# EAGLE design board (EAGLE 9.2.2)
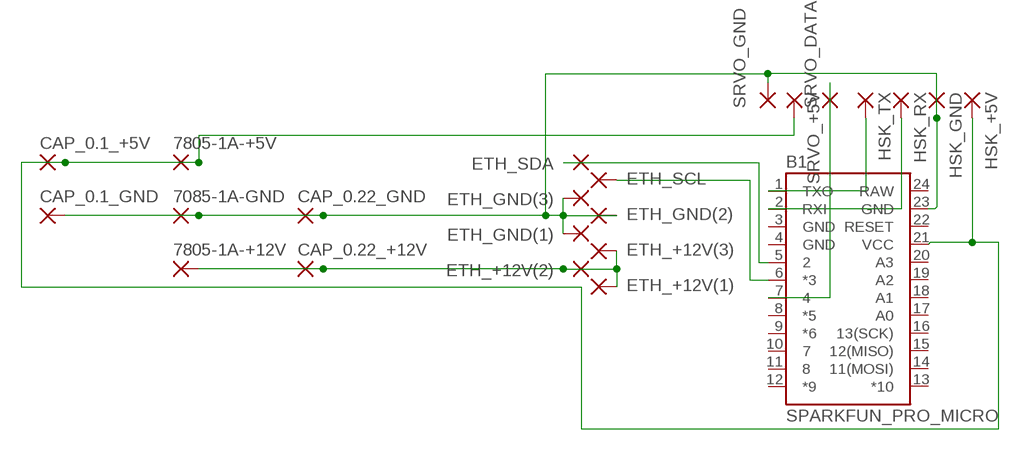
[diagram p0: schematic, sheet 1]

## Parts
7085-1A-GND  2,15/1,0  [2,15/1,0]
7805-1A-+5V  2,15/1,0  [2,15/1,0]
7805-1A-+12V  2,15/1,0  [2,15/1,0]
B1  SPARKFUN_PRO_MICRO  [SPARKFUN_PRO_MICRO]
CAP_0.1_+5V  2,15/1,0  [2,15/1,0]
CAP_0.1_GND  2,15/1,0  [2,15/1,0]
CAP_0.22_+12V  2,15/1,0  [2,15/1,0]
CAP_0.22_GND  2,15/1,0  [2,15/1,0]
ETH_+12V(1)  2,15/1,0  [2,15/1,0]
ETH_+12V(2)  2,15/1,0  [2,15/1,0]
ETH_+12V(3)  2,15/1,0  [2,15/1,0]
ETH_GND(1)  2,15/1,0  [2,15/1,0]
ETH_GND(2)  2,15/1,0  [2,15/1,0]
ETH_GND(3)  2,15/1,0  [2,15/1,0]
ETH_SCL  2,15/1,0  [2,15/1,0]
ETH_SDA  2,15/1,0  [2,15/1,0]
HSK_+5V  2,15/1,0  [2,15/1,0]
HSK_GND  2,15/1,0  [2,15/1,0]
HSK_RX  2,15/1,0  [2,15/1,0]
HSK_TX  2,15/1,0  [2,15/1,0]
SRVO_+5V  2,15/1,0  [2,15/1,0]
SRVO_DATA  2,15/1,0  [2,15/1,0]
SRVO_GND  2,15/1,0  [2,15/1,0]

## Nets
N$1: B1.5 ETH_SDA.1(P)
N$2: 7805-1A-+12V.1(P) CAP_0.22_+12V.1(P) ETH_+12V(1).1(P) ETH_+12V(2).1(P) ETH_+12V(3).1(P)
N$3: B1.1(TXO) HSK_TX.1(P)
N$4: B1.2(RXI) HSK_RX.1(P)
N$5: B1.7 SRVO_DATA.1(P)
N$6: 7085-1A-GND.1(P) B1.23(GND) CAP_0.1_GND.1(P) CAP_0.22_GND.1(P) ETH_GND(1).1(P) ETH_GND(2).1(P) ETH_GND(3).1(P) HSK_GND.1(P) SRVO_GND.1(P)
N$7: 7805-1A-+5V.1(P) B1.21(VCC) CAP_0.1_+5V.1(P) HSK_+5V.1(P) SRVO_+5V.1(P)
N$9: B1.6(*3) ETH_SCL.1(P)
Unconnected: B1.8(*5) B1.9(*6) B1.10 B1.11 B1.12(*9) B1.13(*10) B1.14(11(MOSI)) B1.15(12(MISO)) B1.16(13(SCK)) B1.17(A0) B1.18(A1) B1.19(A2) B1.20(A3) B1.22(RESET)

## Power pins joined to a net without a drawn wire
GND: B1.3(GND) B1.4(GND)
RAW: B1.24(RAW)

## Library data of the parts
7085-1A-GND 7805-1A-+5V 7805-1A-+12V CAP_0.1_+5V CAP_0.1_GND CAP_0.22_+12V CAP_0.22_GND ETH_+12V(1) ETH_+12V(2) ETH_+12V(3) ETH_GND(1) ETH_GND(2) ETH_GND(3) ETH_SCL ETH_SDA HSK_+5V HSK_GND HSK_RX HSK_TX SRVO_+5V SRVO_DATA SRVO_GND = wirepad:2,15/1,0: THROUGH-HOLE PAD
B1 = SparkFun-Boards:SPARKFUN_PRO_MICRO: SparkFun Pro Micro Atmega32U4 compatible footprint. SparkFun Products: 3.3V/8MHz <https://www.sparkfun.com/products/12587> 5V/16MHz <https://www.sparkfun.com/products/12640>

## Net classes
0 default: width 1.25 mm, clearance 0.5 mm

## Board
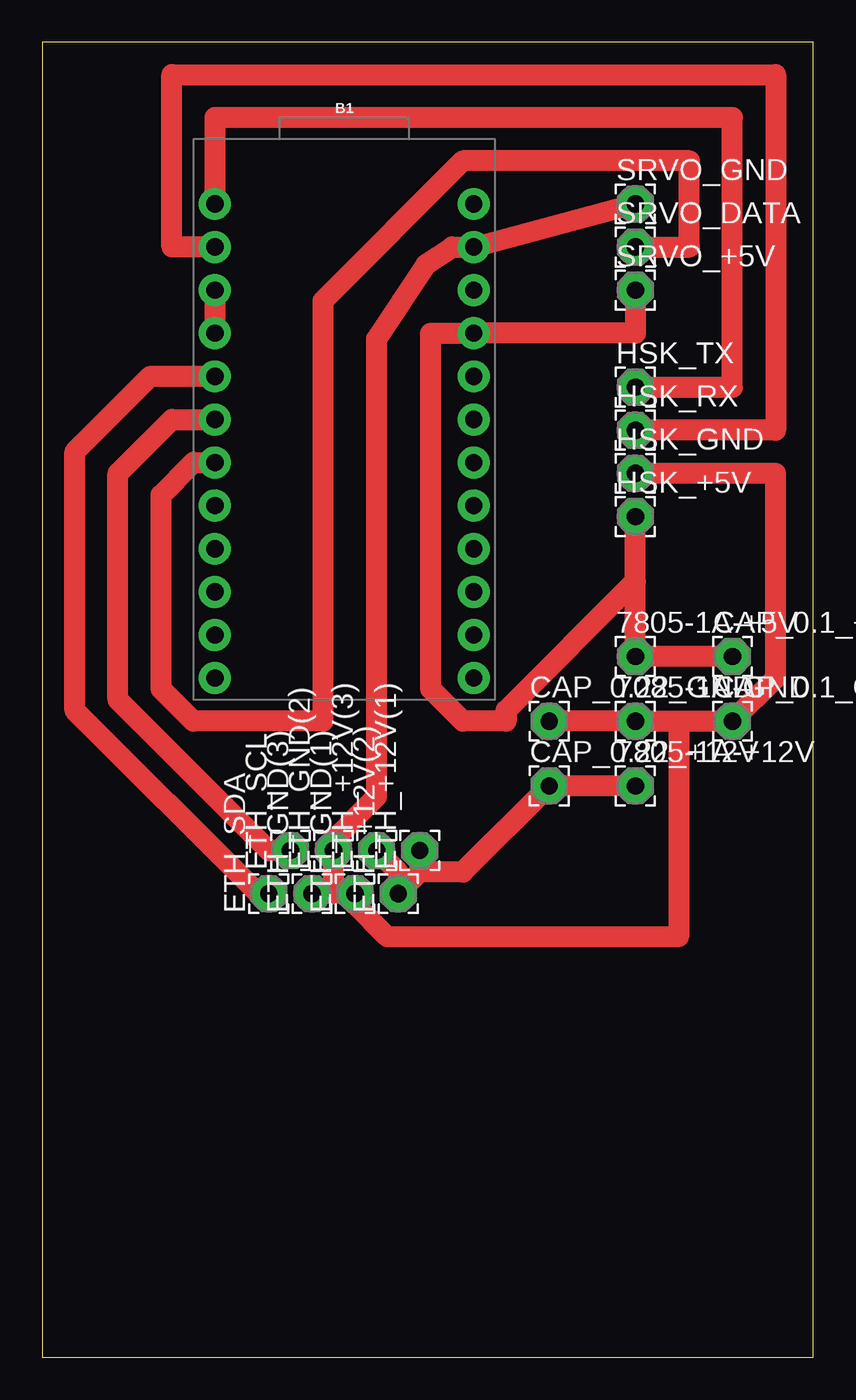
[diagram p1: board, top side]

Size 45.39 x 77.46 mm. Coordinates in mm from the lower left corner, seen from the top.
Outline: 0,0 45.39,0 45.39,77.46 0,77.46 0,0
Copper layers (1*16): Top 0.035mm / dielectric 1.5mm / Bottom 0.035mm
Design rules "default": minimum track width 6mil, minimum drill 0.35mm, track to track 6mil, track to pad 6mil, pad to pad 6mil, via to via 6mil, smd to smd 6mil, copper to edge 40mil, drill to drill 6mil, minimum pad ring 10mil, minimum via ring 8mil, stop-mask expansion 4mil, vias tented up to drill 0mil, thermal gap 10mil

### Footprints (pad centres in the part's own frame; a part is rotated, then mirrored left to right if it is on the bottom)
2,15/1,0 = drill 1.016 pad 2.159 octagon: 1 0,0
SPARKFUN_PRO_MICRO = drill 1.016 pad 1.88: 1 -7.62,12.7; 2 -7.62,10.16; 3 -7.62,7.62; 4 -7.62,5.08; 5 -7.62,2.54; 6 -7.62,0; 7 -7.62,-2.54; 8 -7.62,-5.08; 9 -7.62,-7.62; 10 -7.62,-10.16; 11 -7.62,-12.7; 12 -7.62,-15.24; 13 7.62,-15.24; 14 7.62,-12.7; 15 7.62,-10.16; 16 7.62,-7.62; 17 7.62,-5.08; 18 7.62,-2.54; 19 7.62,0; 20 7.62,2.54; 21 7.62,5.08; 22 7.62,7.62; 23 7.62,10.16; 24 7.62,12.7

### Placement (x,y rotation side)
7085-1A-GND  34.92,37.47 0 top
7805-1A-+5V  34.92,41.27 0 top
7805-1A-+12V  34.92,33.66 0 top
B1  17.78,55.24 0 top
CAP_0.1_+5V  40.64,41.27 0 top
CAP_0.1_GND  40.64,37.47 0 top
CAP_0.22_+12V  29.84,33.66 0 top
CAP_0.22_GND  29.84,37.47 0 top
ETH_+12V(1)  22.22,29.84 90 top
ETH_+12V(2)  20.96,27.3 90 top
ETH_+12V(3)  19.68,29.84 90 top
ETH_GND(1)  18.41,27.3 90 top
ETH_GND(2)  17.14,29.84 90 top
ETH_GND(3)  15.87,27.3 90 top
ETH_SCL  14.61,29.84 90 top
ETH_SDA  13.33,27.3 90 top
HSK_+5V  34.92,49.53 0 top
HSK_GND  34.92,52.07 0 top
HSK_RX  34.92,54.61 0 top
HSK_TX  34.92,57.15 0 top
SRVO_+5V  34.92,62.87 0 top
SRVO_DATA  34.92,65.41 0 top
SRVO_GND  34.92,67.94 0 top

### Tracks (layer width: path | path; a pad name or v marks a point on that pad's centre or on a via)
GND
  Top 1.25: B1.3 B1.4
N$1
  Top 1.25: B1.5 6.35,57.78 1.9,53.34 1.9,38.1 12.7,27.3 ETH_SDA.1
N$2
  Top 1.25: 22.22,28.57 ETH_+12V(2).1 20.96,28.57 ETH_+12V(3).1 | ETH_+12V(1).1 22.22,28.57 | 7805-1A-+12V.1 CAP_0.22_+12V.1 24.76,28.57 22.22,28.57
N$3
  Top 1.25: B1.1 10.16,73.03 40.64,73.03 40.64,57.15 HSK_TX.1
N$4
  Top 1.25: B1.2 7.62,65.41 7.62,75.56 43.18,75.56 43.18,54.61 HSK_RX.1
N$5
  Top 1.25: SRVO_DATA.1 38.1,65.41 38.1,70.48 24.76,70.48 16.51,62.23 16.51,37.47 8.89,37.47 6.98,39.37 6.98,50.8 8.89,52.7 B1.7
N$6
  Top 1.25: 17.14,27.3 ETH_GND(1).1 18.41,26.67 20.32,24.77 37.47,24.77 37.47,37.47 | 17.14,27.3 ETH_GND(3).1 | 17.14,27.3 ETH_GND(2).1 17.14,30.48 19.68,33.02 19.68,60.01 22.61,64.39 24.13,65.41 B1.23 SRVO_GND.1 | CAP_0.22_GND.1 7085-1A-GND.1 37.47,37.47 | 37.47,37.47 CAP_0.1_GND.1 43.18,40 43.18,52.07 HSK_GND.1
N$7
  Top 1.25: SRVO_+5V.1 34.92,60.33 B1.21 22.86,60.33 22.86,39.37 24.76,37.47 27.3,37.47 27.3,38.1 34.92,45.72 | CAP_0.1_+5V.1 7805-1A-+5V.1 34.92,45.72 | 34.92,45.72 HSK_+5V.1
N$9
  Top 1.25: ETH_SCL.1 13.33,29.84 4.44,38.73 4.44,52.07 7.62,55.24 B1.6